# EAGLE design SSB Transceiver_TXPWR-Switch (EAGLE 9.4.2)
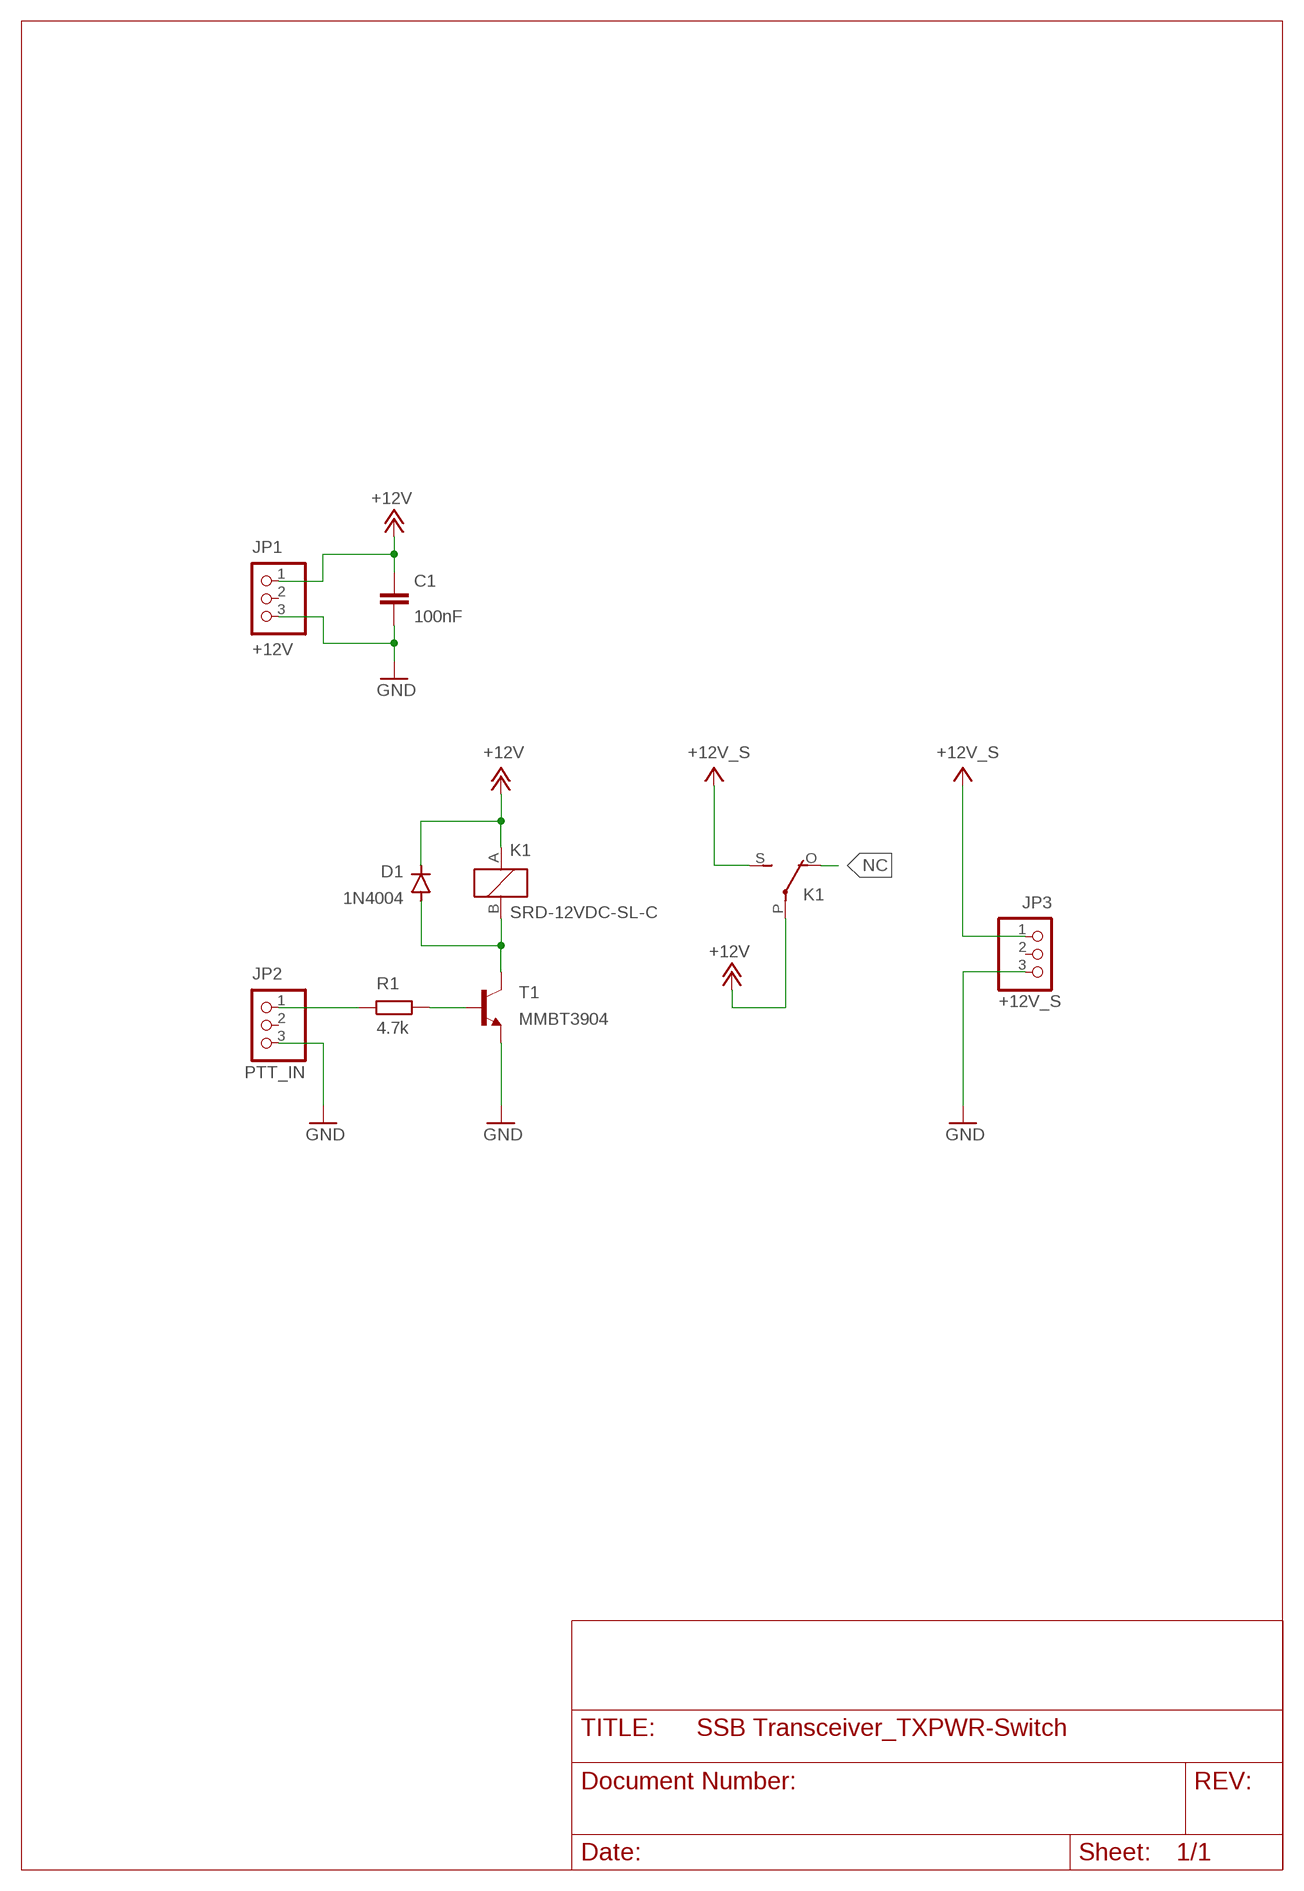
[diagram p0: schematic, sheet 1]

## Parts
C1  100nF  C-EUC0805K  [C0805K]
D1  1N4004  [DO41-10]
JP1  +12V  PINHD-1X3  [1X03]
JP2  PTT_IN  PINHD-1X3  [1X03]
JP3  +12V_S  PINHD-1X3  [1X03]
K1  SRD-12VDC-SL-C  [SRD-12VDC-SL-C]
R1  4.7k  R-EU_R0805  [R0805]
T1  MMBT3904  MMBT3904LT1-NPN-SOT23-BEC  [SOT23-BEC]

## Nets
+12V: C1.1 D1.C JP1.1 K1.A(1:A) K1.P
+12V_S: JP3.1 K1.S
GND: C1.2 JP1.3 JP2.3 JP3.3 T1.E
N$1: R1.2 T1.B
N$2: D1.A K1.B(1:B) T1.C
N$3: JP2.1 R1.1
NC: K1.O
Unconnected: JP1.2 JP2.2 JP3.2

## Library data of the parts
C1 = rcl:C-EU: CAPACITOR, European symbol; SPICEPREFIX: C
D1 = diode:1N4004: DIODE general purpose rectifier, 1 A
JP1-JP3 = pinhead:PINHD-1X3: PIN HEADER
K1 = Ham Radio:SRD-12VDC-SL-C: RELAY horizontal, 1 x switch, 5 A/300 V DC, 250 V AC, Siemens
R1 = rcl:R-EU_: RESISTOR, European symbol; SPICEPREFIX: R
T1 = transistor:*-NPN-: NPN Transistror BF959 corrected 2008.03.06

## Board
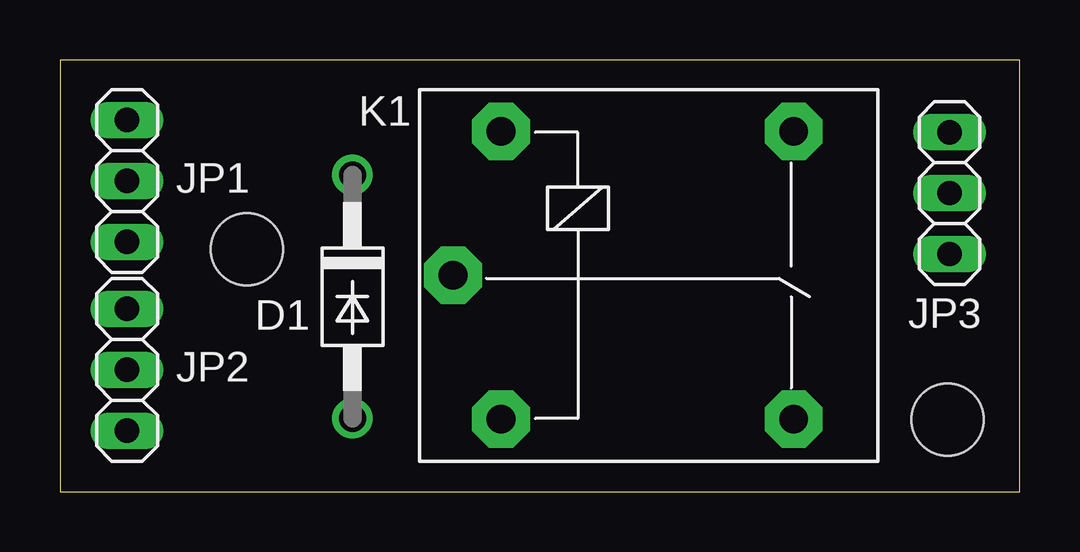
[diagram p1: board, top side]
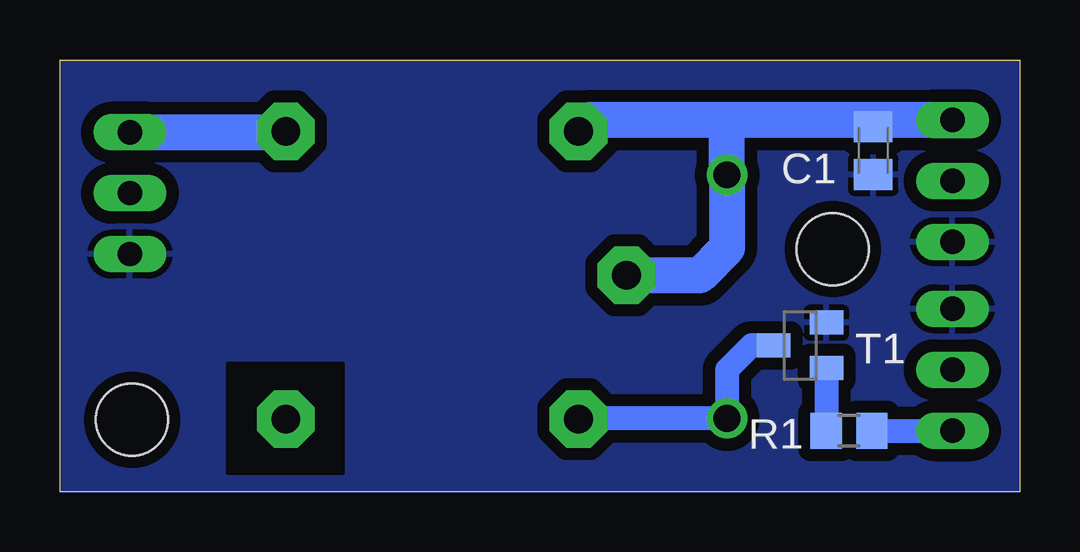
[diagram p2: board, bottom side, seen from below]

Size 40 x 18 mm. Coordinates in mm from the lower left corner, seen from the top.
Outline: 0,0 40,0 40,18 0,18 0,0
Copper layers (1*16): Top 0.035mm / dielectric 1.5mm / Bottom 0.035mm
Design rules "default *": minimum track width 6mil, minimum drill 0.35mm, track to track 20mil, track to pad 20mil, pad to pad 20mil, via to via 20mil, smd to smd 6mil, copper to edge 0mil, drill to drill 6mil, minimum pad ring 10mil, minimum via ring 8mil, stop-mask expansion 4mil, vias tented up to drill 0mil, thermal gap 10mil
Holes 3 mm at 37,3 7.79,10.11

### Footprints (pad centres in the part's own frame; a part is rotated, then mirrored left to right if it is on the bottom)
C0805K = smd 1.3 x 1.6: 1 -1,0; 2 1,0
DO41-10 = drill 1.118: A 5.08,0; C -5.08,0
1X03 = drill 1.016 long: 1 -2.54,0; 2 0,0; 3 2.54,0
SRD-12VDC-SL-C = drill 1.2 pad 2.4 octagon: A -5.998,6.13; B -5.998,-5.87; O 6.202,-5.87; P -7.998,0.13; S 6.202,6.13
R0805 = smd 1.3 x 1.5: 1 -0.95,0; 2 0.95,0
SOT23-BEC = smd 1 x 1.4: B -0.95,-1.1; C 0,1.1; E 0.95,-1.1

### Placement (x,y rotation side)
C1  6.1,14.22 270 bottom
D1  12.19,8.13 270 top
JP1  2.79,12.95 270 top
JP2  2.79,5.08 90 top
JP3  37.08,12.45 270 top
K1  24.38,8.89 0 top
R1  7.11,2.54 180 bottom
T1  9.14,6.1 90 bottom

### Tracks (layer width: path | path; a pad name or v marks a point on that pad's centre or on a via)
+12V
  Bottom 1: C1.1 6.1,15.49
  Bottom 1.5: JP1.1 6.1,15.49 12.19,15.49 | 12.19,15.49 17.91,15.49 K1.A | 12.19,15.49 D1.C 12.19,10.16 13.33,9.02 K1.P
+12V_S
  Bottom 1.5: JP3.1 30.62,14.99 K1.S
GND
  pour Bottom (isolate 0.5): 0,0 0,18 40,18 40,0
  cutout Bottom (no thermals): 28.19,5.33 33.02,5.33 33.02,0.76 28.19,0.76
N$1
  Bottom 1: T1.B 8.04,2.56 R1.2
N$2
  Bottom 1: T1.C 11.18,6.1 12.19,5.08 D1.A 18.36,3.05 K1.B
N$3
  Bottom 1: R1.1 JP2.1